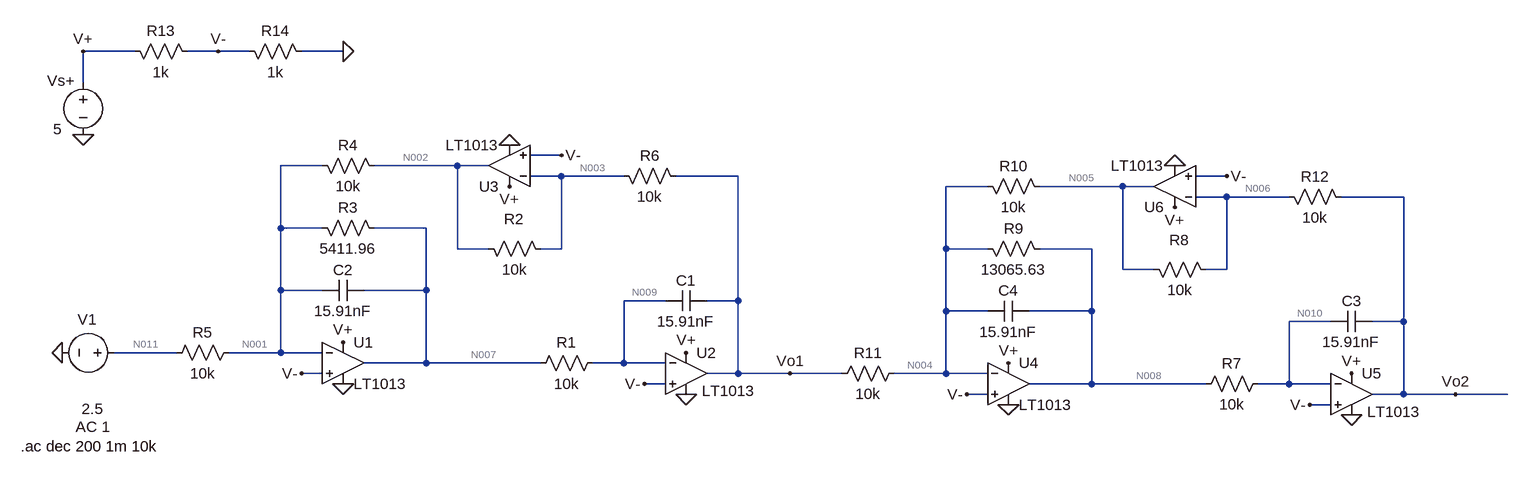
[diagram p0: schematic Project2.asc]
Project2.asc, the LTspice schematic file:
Version 4
SHEET 1 1812 680
WIRE -304 -256 -384 -256
WIRE -176 -256 -224 -256
WIRE -128 -256 -176 -256
WIRE 16 -256 -48 -256
WIRE -384 -208 -384 -256
WIRE 352 -96 304 -96
WIRE -16 -80 -80 -80
WIRE 192 -80 64 -80
WIRE 240 -80 192 -80
WIRE 352 -64 304 -64
WIRE 448 -64 352 -64
WIRE 624 -64 528 -64
WIRE 1376 -64 1328 -64
WIRE 1008 -48 944 -48
WIRE 1216 -48 1088 -48
WIRE 1264 -48 1216 -48
WIRE 1376 -32 1328 -32
WIRE 1472 -32 1376 -32
WIRE 1648 -32 1552 -32
WIRE -80 16 -80 -80
WIRE -16 16 -80 16
WIRE 144 16 64 16
WIRE 192 48 192 -80
WIRE 240 48 192 48
WIRE 352 48 352 -64
WIRE 352 48 320 48
WIRE 944 48 944 -48
WIRE 1008 48 944 48
WIRE 1168 48 1088 48
WIRE 1216 80 1216 -48
WIRE 1264 80 1216 80
WIRE 1376 80 1376 -32
WIRE 1376 80 1344 80
WIRE -80 112 -80 16
WIRE -16 112 -80 112
WIRE 144 112 144 16
WIRE 144 112 48 112
WIRE 512 128 448 128
WIRE 624 128 624 -64
WIRE 624 128 576 128
WIRE 944 144 944 48
WIRE 1008 144 944 144
WIRE 1168 144 1168 48
WIRE 1168 144 1072 144
WIRE 1536 160 1472 160
WIRE 1648 160 1648 -32
WIRE 1648 160 1600 160
WIRE -240 208 -336 208
WIRE -80 208 -80 112
WIRE -80 208 -160 208
WIRE -16 208 -80 208
WIRE 144 224 144 112
WIRE 144 224 48 224
WIRE 320 224 144 224
WIRE 448 224 448 128
WIRE 448 224 400 224
WIRE 512 224 448 224
WIRE -16 240 -48 240
WIRE 624 240 624 128
WIRE 624 240 576 240
WIRE 704 240 624 240
WIRE 784 240 704 240
WIRE 944 240 944 144
WIRE 944 240 864 240
WIRE 1008 240 944 240
WIRE 512 256 480 256
WIRE 1168 256 1168 144
WIRE 1168 256 1072 256
WIRE 1344 256 1168 256
WIRE 1472 256 1472 160
WIRE 1472 256 1424 256
WIRE 1536 256 1472 256
WIRE 1008 272 976 272
WIRE 1648 272 1648 160
WIRE 1648 272 1600 272
WIRE 1728 272 1648 272
WIRE 1808 272 1728 272
WIRE 1536 288 1504 288
FLAG -384 -128 0
FLAG -384 -256 V+
FLAG 272 -48 V+
FLAG 544 208 V+
FLAG 16 192 V+
FLAG -416 208 0
FLAG 704 240 Vo1
FLAG 1296 -16 V+
FLAG 1568 240 V+
FLAG 1040 224 V+
FLAG 1728 272 Vo2
FLAG 16 -256 0
FLAG -176 -256 V-
FLAG 1040 288 0
FLAG 1568 304 0
FLAG 1296 -80 0
FLAG 272 -112 0
FLAG 544 272 0
FLAG 16 256 0
FLAG 352 -96 V-
FLAG -48 240 V-
FLAG 480 256 V-
FLAG 976 272 V-
FLAG 1376 -64 V-
FLAG 1504 288 V-
SYMBOL OpAmps\\LT1013 16 160 R0
SYMATTR InstName U1
SYMBOL OpAmps\\LT1013 544 176 R0
WINDOW 3 24 91 Left 2
SYMATTR InstName U2
SYMBOL OpAmps\\LT1013 272 -16 R180
SYMATTR InstName U3
SYMBOL res 416 208 R90
WINDOW 0 0 56 VBottom 2
WINDOW 3 32 56 VTop 2
SYMATTR InstName R1
SYMATTR Value 10k
SYMBOL cap 576 112 R90
WINDOW 0 0 32 VBottom 2
WINDOW 3 32 32 VTop 2
SYMATTR InstName C1
SYMATTR Value 15.91nF
SYMBOL cap 48 96 R90
WINDOW 0 0 32 VBottom 2
WINDOW 3 32 32 VTop 2
SYMATTR InstName C2
SYMATTR Value 15.91nF
SYMBOL res 224 32 M90
WINDOW 0 -14 55 VBottom 2
WINDOW 3 32 56 VTop 2
SYMATTR InstName R2
SYMATTR Value 10k
SYMBOL res -32 0 M90
WINDOW 0 0 56 VBottom 2
WINDOW 3 32 56 VTop 2
SYMATTR InstName R3
SYMATTR Value 5411.96
SYMBOL res -32 -96 M90
WINDOW 0 0 56 VBottom 2
WINDOW 3 32 56 VTop 2
SYMATTR InstName R4
SYMATTR Value 10k
SYMBOL res -144 192 R90
WINDOW 0 0 56 VBottom 2
WINDOW 3 32 56 VTop 2
SYMATTR InstName R5
SYMATTR Value 10k
SYMBOL voltage -384 -224 R0
WINDOW 0 -55 13 Left 2
WINDOW 3 -46 88 Left 2
SYMATTR InstName Vs+
SYMATTR Value 5
SYMBOL res 432 -80 M90
WINDOW 0 0 56 VBottom 2
WINDOW 3 32 56 VTop 2
SYMATTR InstName R6
SYMATTR Value 10k
SYMBOL voltage -320 208 R90
WINDOW 0 -36 58 VBottom 2
WINDOW 3 102 49 VBottom 2
WINDOW 123 130 49 VBottom 2
WINDOW 39 0 0 Left 0
SYMATTR InstName V1
SYMATTR Value 2.5
SYMATTR Value2 AC 1
SYMBOL OpAmps\\LT1013 1040 192 R0
SYMATTR InstName U4
SYMBOL OpAmps\\LT1013 1568 208 R0
WINDOW 3 24 91 Left 2
SYMATTR InstName U5
SYMBOL OpAmps\\LT1013 1296 16 R180
SYMATTR InstName U6
SYMBOL res 1440 240 R90
WINDOW 0 0 56 VBottom 2
WINDOW 3 32 56 VTop 2
SYMATTR InstName R7
SYMATTR Value 10k
SYMBOL cap 1600 144 R90
WINDOW 0 0 32 VBottom 2
WINDOW 3 32 32 VTop 2
SYMATTR InstName C3
SYMATTR Value 15.91nF
SYMBOL cap 1072 128 R90
WINDOW 0 0 32 VBottom 2
WINDOW 3 32 32 VTop 2
SYMATTR InstName C4
SYMATTR Value 15.91nF
SYMBOL res 1248 64 M90
WINDOW 0 -14 55 VBottom 2
WINDOW 3 32 56 VTop 2
SYMATTR InstName R8
SYMATTR Value 10k
SYMBOL res 992 32 M90
WINDOW 0 0 56 VBottom 2
WINDOW 3 32 56 VTop 2
SYMATTR InstName R9
SYMATTR Value 13065.63
SYMBOL res 992 -64 M90
WINDOW 0 0 56 VBottom 2
WINDOW 3 32 56 VTop 2
SYMATTR InstName R10
SYMATTR Value 10k
SYMBOL res 880 224 R90
WINDOW 0 0 56 VBottom 2
WINDOW 3 32 56 VTop 2
SYMATTR InstName R11
SYMATTR Value 10k
SYMBOL res 1456 -48 M90
WINDOW 0 0 56 VBottom 2
WINDOW 3 32 56 VTop 2
SYMATTR InstName R12
SYMATTR Value 10k
SYMBOL res -320 -272 M90
WINDOW 0 0 56 VBottom 2
WINDOW 3 32 56 VTop 2
SYMATTR InstName R13
SYMATTR Value 1k
SYMBOL res -144 -272 M90
WINDOW 0 0 56 VBottom 2
WINDOW 3 32 56 VTop 2
SYMATTR InstName R14
SYMATTR Value 1k
TEXT -480 352 Left 2 !.ac dec 200 1m 10k

The netlist it stands for:
* Project2.asc
XU1 V- N001 V+ 0 N007 LT1013  ; pins In+ In- V+ V- OUT
XU2 V- N009 V+ 0 Vo1 LT1013  ; pins In+ In- V+ V- OUT
XU3 V- N003 V+ 0 N002 LT1013  ; pins In+ In- V+ V- OUT
R1 N009 N007 10k
C1 Vo1 N009 15.91nF
C2 N007 N001 15.91nF
R2 N002 N003 10k
R3 N001 N007 5411.96
R4 N001 N002 10k
R5 N001 N011 10k
Vs+ V+ 0 5
R6 N003 Vo1 10k
V1 N011 0 2.5 AC 1
XU4 V- N004 V+ 0 N008 LT1013  ; pins In+ In- V+ V- OUT
XU5 V- N010 V+ 0 Vo2 LT1013  ; pins In+ In- V+ V- OUT
XU6 V- N006 V+ 0 N005 LT1013  ; pins In+ In- V+ V- OUT
R7 N010 N008 10k
C3 Vo2 N010 15.91nF
C4 N008 N004 15.91nF
R8 N005 N006 10k
R9 N004 N008 13065.63
R10 N004 N005 10k
R11 N004 Vo1 10k
R12 N006 Vo2 10k
R13 V+ V- 1k
R14 V- 0 1k
.ac dec 200 1m 10k
.lib LTC.lib
.backanno
.end

* Results of the author's LTspice run, read from the files saved beside the schematic
* Operating Point, zero values left out:
*   V(n001) = 2.5 V
*   V(v-) = 2.5 V
*   V(v+) = 5 V
*   V(n007) = 2.5 V
*   V(n009) = 2.5 V
*   V(vo1) = 2.5 V
*   V(n003) = 2.5 V
*   V(n002) = 2.5 V
*   V(n011) = 2.5 V
*   V(n004) = 2.5 V
*   V(n008) = 2.5 V
*   V(n010) = 2.5 V
*   V(vo2) = 2.5 V
*   V(n006) = 2.5 V
*   V(n005) = 2.5 V
*   I(R14) = 2.5 mA
*   I(R13) = 2.5 mA
*   I(R12) = 34.96 nA
*   I(R11) = 25.77 nA
*   I(R10) = -22.96 nA
*   I(R9) = 9.185 nA
*   I(R8) = 22.96 nA
*   I(R7) = 12 nA
*   I(R6) = 25.77 nA
*   I(R5) = 3.599 nA
*   I(R4) = -13.77 nA
*   I(R3) = 22.17 nA
*   I(R2) = 13.77 nA
*   I(R1) = 12 nA
*   I(V1) = 3.599 nA
*   I(Vs+) = -4.6 mA
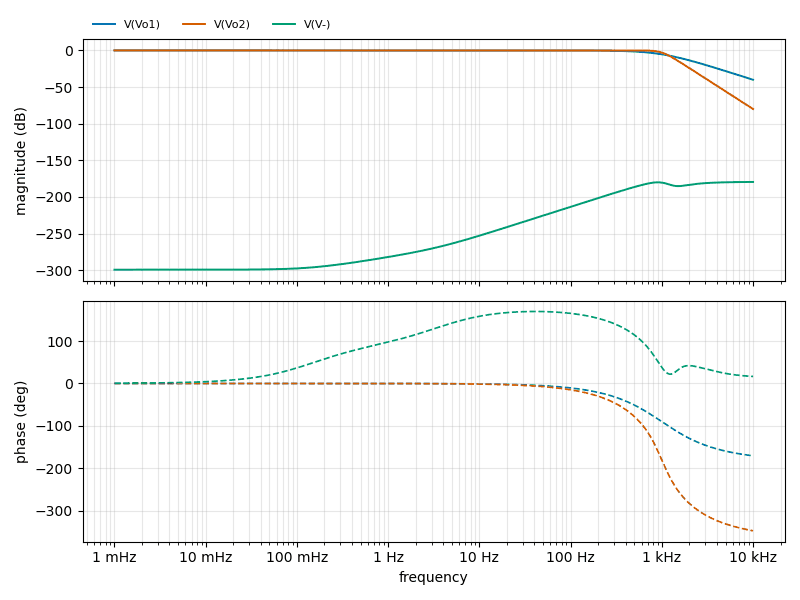
[diagram p1: AC Analysis of Project2.asc, plotted from the saved traces]
* AC Analysis, 1 run:
*   V(Vo1): 0.00 dB at 1 mHz, -40.07 dB at 10 kHz, peak 0.00 dB at 1 mHz, 3 dB below the peak at 721.2 Hz
*   V(Vo2): 0.00 dB at 1 mHz, -80.01 dB at 10 kHz, peak 0.01 dB at 412.1 Hz, 3 dB below the peak at 1.002 kHz
*   V(V-): -299.35 dB at 1 mHz, -179.56 dB at 10 kHz, peak -179.56 dB at 10 kHz, 3 dB below the peak at 2.259 kHz